# EAGLE design v1 (EAGLE 9.6.2)
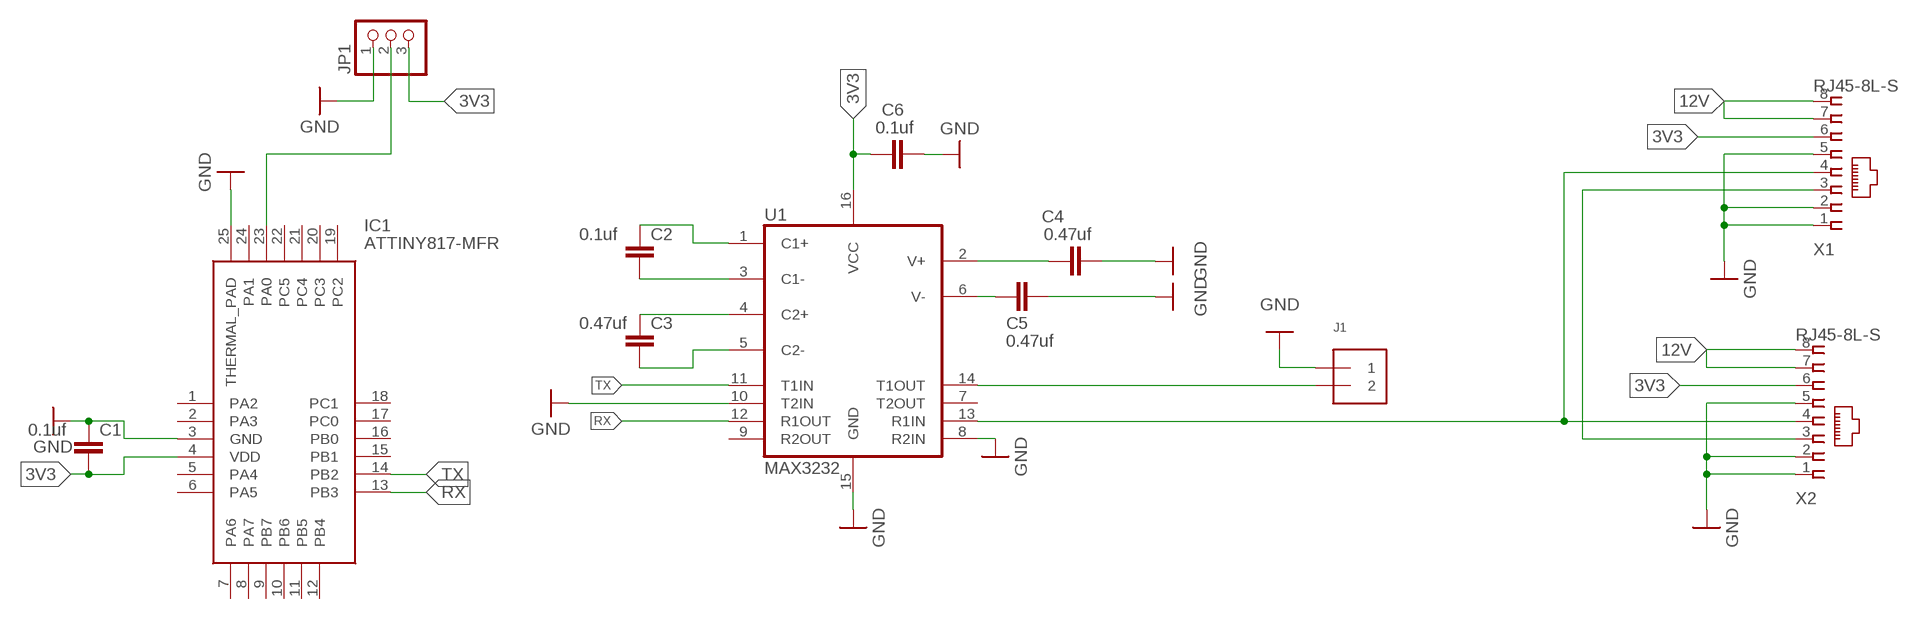
[diagram p0: schematic, sheet 1]

## Parts
C1  0.1uf  C-EUC0805  [C0805]
C2  0.1uf  C-EUC0805  [C0805]
C3  0.47uf  C-EUC0805  [C0805]
C4  0.47uf  C-EUC0805  [C0805]
C5  0.47uf  C-EUC0805  [C0805]
C6  0.1uf  C-EUC0805  [C0805]
IC1  ATTINY817-MFR  [QFN50P400X400X90-25N]
J1  TERMBLOCK_1X2  [TERMBLOCK_1X2-3.5MM]
JP1  PINHD-1X3  [1X03]
U1  MAX3232  MAX2323SOIC16  [SO16]
X1  RJ45-8L-S  [RJ45-NO-SHIELD]
X2  RJ45-8L-S  [RJ45-NO-SHIELD]

## Nets
3V3: C1.2 C6.2 IC1.4(VDD) JP1.3 U1.16(VCC) X1.6 X2.6
12V: X1.7 X1.8 X2.7 X2.8
GND: C1.1 C4.1 C5.1 C6.1 IC1.3(GND) IC1.25(THERMAL_PAD) J1.1 JP1.1 U1.8(R2IN) U1.10(T2IN) U1.15(GND) X1.1 X1.2 X1.5 X2.1 X2.2 X2.5
N$1: X1.3 X2.3
N$2: J1.2 U1.14(T1OUT)
N$3: IC1.23(PA0) JP1.2
N$11: C2.1 U1.1(C1+)
N$12: C2.2 U1.3(C1-)
N$13: C3.1 U1.4(C2+)
N$14: C3.2 U1.5(C2-)
N$15: C4.2 U1.2(V+)
N$16: C5.2 U1.6(V-)
N$34: U1.13(R1IN) X1.4 X2.4
RX: IC1.13(PB3) U1.12(R1OUT)
TX: IC1.14(PB2) U1.11(T1IN)
Unconnected: IC1.1(PA2) IC1.2(PA3) IC1.5(PA4) IC1.6(PA5) IC1.7(PA6) IC1.8(PA7) IC1.9(PB7) IC1.10(PB6) IC1.11(PB5) IC1.12(PB4) IC1.15(PB1) IC1.16(PB0) IC1.17(PC0) IC1.18(PC1) IC1.19(PC2) IC1.20(PC3) IC1.21(PC4) IC1.22(PC5) IC1.24(PA1) U1.7(T2OUT) U1.9(R2OUT)

## Library data of the parts
C1-C6 = resistor:C-EU: CAPACITOR, European symbol
IC1 = ATTINY817-MFR:ATTINY817-MFR: 8-bit Microcontrollers - MCU AVR 8-bit Microcontroller Source: Datasheet <http://www.mouser.com/ds/2/268/Atmel-42721-AVR-ATtiny417-814-816-817_Complete-1025976.pdf>; DESCRIPTION: 8-bit Microcontrollers - MCU AVR 8-bit Microcontroller; HEIGHT: 0.9mm; MANUFACTURER_NAME: Microchip; MANUFACTURER_PART_NUMBER: ATTINY817-MFR; MOUSER_PART_NUMBER: 579-ATTINY817-MFR; MOUSER_PRICE-STOCK: https://www.mouser.com/Search/Refine.aspx?Keyword=579-ATTINY817-MFR; RS_PART_NUMBER: 1682807P; RS_PRICE-STOCK: http://uk.rs-online.com/web/p/products/1682807P
J1 = microbuilder:TERMBLOCK_1X2: 3.5mm Terminal block http://www.ladyada.net/library/pcb/eaglelibrary.html
JP1 = adafruit:PINHD-1X3: PIN HEADER
U1 = SparkFun-IC-Comms:MAX2323: RS232 Transceiver This part covers 232 drivers that are compatible with the MAX3232. Sipex SP3232EB Datasheet <http://cdn.sparkfun.com/datasheets/Components/General%20IC/SP3232EBCA-L.pdf> SparkFun Products SOIC component <https://www.sparkfun.com/products/589> (COM-00589 / IC-08171) Retired DIP component (COM-00316 / IC-08446) SparkFun Transceiver Breakout - MAX3232 <https://www.sparkfun.com/products/11189> (BOB-11189) SparkFun XBee Explorer Serial <https://www.sparkfun.com/products/13225> (WRL-13225); PROD_ID: IC-08171
X1 X2 = con-tycoelectronics:RJ45: CORCOM Modular RJ Jacks No Shield Source: www.tycoelectronics.com .. ENG_DS_1654001_1099_RJ_L_0507.pdf; MF: TYCO ELECTRONICS; MPN: RJ45-8L-S; OC_FARNELL: unknown; OC_NEWARK: 80K9067

## Board
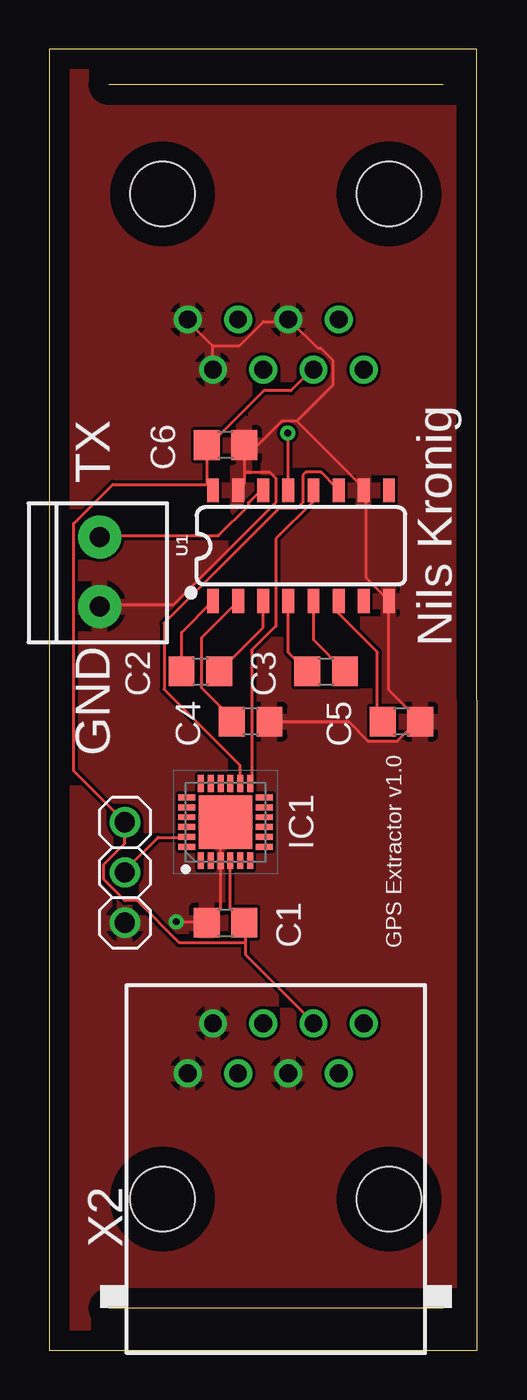
[diagram p1: board, top side]
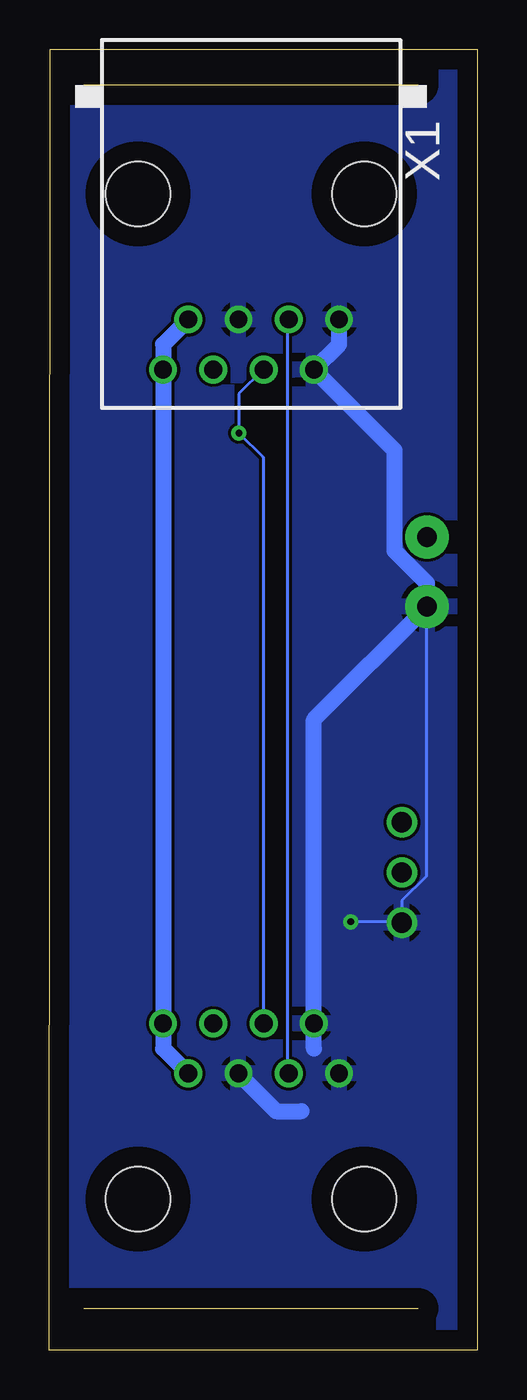
[diagram p2: board, bottom side, seen from below]

Size 21.61 x 65.71 mm. Coordinates in mm from the lower left corner, seen from the top.
Outline: 0,0 21.61,0 21.57,65.71 0,65.71 0,0
Copper layers (1*16): Top 0.035mm / dielectric 1.5mm / Bottom 0.035mm
Design rules "default": minimum track width 6mil, minimum drill 0.35mm, track to track 6mil, track to pad 6mil, pad to pad 6mil, via to via 6mil, smd to smd 6mil, copper to edge 40mil, drill to drill 6mil, minimum pad ring 10mil, minimum via ring 8mil, stop-mask expansion 4mil, vias tented up to drill 0mil, thermal gap 10mil

### Footprints (pad centres in the part's own frame; a part is rotated, then mirrored left to right if it is on the bottom)
C0805 = smd 1.3 x 1.5: 1 -0.95,0; 2 0.95,0
QFN50P400X400X90-25N = smd 0.85 x 0.3: 1 -1.95,1.25; 2 -1.95,0.75; 3 -1.95,0.25; 4 -1.95,-0.25; 5 -1.95,-0.75; 6 -1.95,-1.25; 13 1.95,-1.25; 14 1.95,-0.75; 15 1.95,-0.25; 16 1.95,0.25; 17 1.95,0.75; 18 1.95,1.25 | smd 0.3 x 0.85: 7 -1.25,-1.95; 8 -0.75,-1.95; 9 -0.25,-1.95; 10 0.25,-1.95; 11 0.75,-1.95; 12 1.25,-1.95; 19 1.25,1.95; 20 0.75,1.95; 21 0.25,1.95; 22 -0.25,1.95; 23 -0.75,1.95; 24 -1.25,1.95 | smd 2.7 x 2.7: 25 0,0
TERMBLOCK_1X2-3.5MM = drill 1 pad 2.184: 1 1.8,0; 2 -1.7,0
1X03 = drill 1.016: 1 -2.54,0; 2 0,0; 3 2.54,0
SO16 = smd 0.6 x 1.2: 1 -4.445,-2.8; 2 -3.175,-2.8; 3 -1.905,-2.8; 4 -0.635,-2.8; 5 0.635,-2.8; 6 1.905,-2.8; 7 3.175,-2.8; 8 4.445,-2.8; 9 4.445,2.8; 10 3.175,2.8; 11 1.905,2.8; 12 0.635,2.8; 13 -0.635,2.8; 14 -1.905,2.8; 15 -3.175,2.8; 16 -4.445,2.8
RJ45-NO-SHIELD = drill 0.9 pad 1.4: 1 -4.445,6.35; 2 -3.175,8.89; 3 -1.905,6.35; 4 -0.635,8.89; 5 0.635,6.35; 6 1.905,8.89; 7 3.175,6.35; 8 4.445,8.89 | hole 3.251: -5.715,0; 5.715,0

### Placement (x,y rotation side)
C1  8.89,21.59 0 top
C2  7.62,34.29 0 top
C3  13.97,34.29 0 top
C4  10.16,31.75 180 top
C5  17.78,31.75 180 top
C6  8.89,45.72 180 top
IC1  8.89,26.67 90 top
J1  2.54,39.37 270 top
JP1  3.81,24.13 90 top
U1  12.7,40.64 0 top
X1  11.43,58.42 180 bottom
X2  11.43,7.62 0 top

### Tracks (layer width: path | path; a pad name or v marks a point on that pad's centre or on a via)
3V3
  Top 0.152: 7.94,43.76 C6.2 8.08,45.72 10.82,48.46 12.19,48.46 13.26,49.53 X1.6 | 7.94,43.76 U1.16 | IC1.4 9.14,22.29 C1.2 9.91,21.49 9.91,20.57 | 9.91,20.57 9.91,19.96 13.26,16.61 X2.6 | 9.91,20.57 6.55,20.57 4.42,22.71 3.81,22.71 2.74,23.77 2.74,24.54 3.81,25.6 JP1.3 1.22,29.26 1.22,41.76 3.2,43.74 7.92,43.74 7.94,43.76
12V
  Bottom 0.813: X1.7 15.88,50.8 X1.8 X2.8 15.88,15.24 X2.7
GND  (via drill 0.35)
  Top 0.152: C4.1 15.11,31.75 16.09,30.77 17.57,30.77 18.55,31.75 C5.1 17.14,33.34 U1.8 17.07,37.95 16,39.01 16,43.43 U1.10 15.85,43.59 12.5,46.94 | 9.84,44.35 C6.1 10.52,45.72 11.73,46.94 12.5,46.94 | 9.84,44.35 9.84,43.76 U1.15 | IC1.25 8.64,26.42 IC1.3 8.64,22.29 C1.1 7.92,21.64 v6.4,21.64 | 3.81,21.03 JP1.1 | 8.23,50.75 8.23,49.53 X1.2 | 8.23,50.75 7.01,51.97 X1.1 | 8.23,50.75 9.6,50.75 10.82,51.97 12.04,51.97 X1.5 12.19,51.97 13.56,50.6 13.72,50.6 14.33,49.99 14.33,48.77 12.5,46.94 | 9.84,44.35 11.12,44.35 11.43,44.04 11.43,42.82 6.25,37.64 2.59,37.64 J1.1
  Bottom 0.152: 3.81,21.64 v6.4,21.64 | 3.81,21.64 3.81,22.71 2.59,23.93 2.59,37.49 J1.1 | 3.81,21.64 JP1.1
  Bottom 0.813: 8.26,15.24 X2.2 8.26,31.86 J1.1 2.54,38.73 4.19,40.39 4.19,45.47 X1.2 6.99,50.8 X1.1 | X2.5 10.16,12.06 8.89,12.06
  pour Bottom: -1.27,0 -1.27,66.04 22.86,66.04 22.86,-1.27 0,-1.27
  pour Top: -1.27,-1.27 -1.27,66.04 22.86,66.04 22.86,-1.27
N$1
  Bottom 0.152: X2.3 9.6,14.02 9.6,51.97 X1.3
N$2
  Top 0.152: U1.14 10.67,43.43 10.06,42.82 10.06,42.67 8.53,41.15 2.59,41.15 J1.2
N$3
  Top 0.152: IC1.23 6.86,25.91 5.49,25.91 3.81,24.23 JP1.2
N$11
  Top 0.152: C2.1 6.67,36.26 U1.1
N$12
  Top 0.152: C2.2 10.79,36.52 U1.3
N$13
  Top 0.152: C3.1 12.06,35.24 U1.4
N$14
  Top 0.152: C3.2 13.34,35.88 U1.5
N$15
  Top 0.152: C4.2 9.21,31.93 7.69,33.45 7.69,36.01 U1.2
N$16
  Top 0.152: C5.2 16.56,32.02 16.56,35.26 14.61,37.22 U1.6
N$34  (via drill 0.35)
  Top 0.152: v12.04,46.33 12.04,43.59 U1.13
  Bottom 0.152: X1.4 10.82,49.53 12.04,48.31 v12.04,46.33 10.82,45.11 10.82,16.61 X2.4
RX
  Top 0.152: IC1.13 10.21,28.65 10.21,35.36 11.43,36.58 11.43,41 13.26,42.82 13.26,43.43 U1.12
TX
  Top 0.152: IC1.14 9.6,28.65 9.6,29.57 5.79,33.38 5.79,36.73 11.58,42.52 12.5,42.52 12.8,42.82 12.8,44.2 12.95,44.35 13.72,44.35 14.48,43.59 U1.11

### Text on the board
tNames: TX | GND | Nils Kronig | GPS Extractor v1.0